# Altium schematic sheet 原理图.SchDoc
size A4
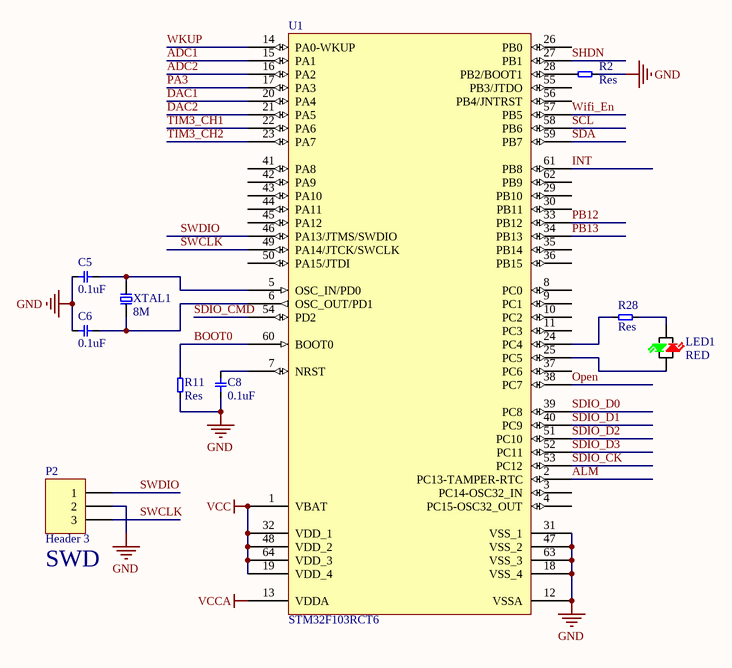
[diagram p0: 原理图.SchDoc]

## Parts
C5  0.1uF  [0603]
C6  0.1uF  [0603]
C8  0.1uF  [0603]
LED1  RED  [LED2]
P2  Header 3  [HDR1X3-150]
R2  Res  [0603]
R11  Res  [0603]
R28  Res  [0603]
U1  STM32F103RCT6  [LQFP64_N]
XTAL1  8M  [XTAL]

## Nets
GND: C5.1 C6.1 C8.1 P2.2 R2.2 R11.1 U1.12(VSSA) U1.18(VSS_4) U1.31(VSS_1) U1.47(VSS_2) U1.63(VSS_3)
VCC: U1.1(VBAT) U1.19(VDD_4) U1.32(VDD_1) U1.48(VDD_2) U1.64(VDD_3)
VCCA: U1.13(VDDA)
ADC1: U1.15(PA1)
ADC2: U1.16(PA2)
ALM: U1.2(PC13-TAMPER-RTC)
BOOT0: R11.2 U1.60(BOOT0)
DAC1: U1.20(PA4)
DAC2: U1.21(PA5)
INT: U1.61(PB8)
Open: U1.38(PC7)
PA3: U1.17(PA3)
PB12: U1.33(PB12)
PB13: U1.34(PB13)
SCL: U1.58(PB6)
SDA: U1.59(PB7)
SDIO_CK: U1.53(PC12)
SDIO_CMD: U1.54(PD2)
SDIO_D0: U1.39(PC8)
SDIO_D1: U1.40(PC9)
SDIO_D2: U1.51(PC10)
SDIO_D3: U1.52(PC11)
SHDN: U1.27(PB1)
SWCLK: P2.3 U1.49(PA14/JTCK/SWCLK)
SWDIO: P2.1 U1.46(PA13/JTMS/SWDIO)
TIM3_CH1: U1.22(PA6)
TIM3_CH2: U1.23(PA7)
Wifi_En: U1.57(PB5)
WKUP: U1.14(PA0-WKUP)
NetC5_2: C5.2 U1.5(OSC_IN/PD0) XTAL1.2
NetC6_2: C6.2 U1.6(OSC_OUT/PD1) XTAL1.1
NetC8_2: C8.2 U1.7(NRST)
NetLED1_1: LED1.1 R28.2
NetLED1_2: LED1.2 U1.25(PC5)
NetR2_1: R2.1 U1.28(PB2/BOOT1)
NetR28_1: R28.1 U1.24(PC4)

Not connected (* = marked no-connect by the designer): U1 3(PC14-OSC32_IN) 4(PC15-OSC32_OUT) 8(PC0) 9(PC1) 10(PC2) 11(PC3) 26(PB0) 29(PB10) 30(PB11) 35(PB14) 36(PB15) 37(PC6) 41(PA8) 42(PA9) 43(PA10) 44(PA11) 45(PA12) 50(PA15/JTDI) 55(PB3/JTDO) 56(PB4/JNTRST) 62(PB9)

## Notes on the sheet
- (near P2) SWD

## Library data of the parts
C5 C6 C8 = C0.1uF
LED1 = LED_2
P2 = Header 3: Header, 3-Pin; LatestRevisionDate: 17-Jul-2002; LatestRevisionNote: Re-released for DXP Platform.; Publisher: Altium Limited
U1 = STM32F103RBT6: STM32 ARM-based 32-bit MCU with 128 Kbytes Flash, 64-pin LQFP, Industrial Temperature; Published: 30-May-2008; DatasheetVersion: rev6, Mar-2008; PackageVersion: Mar-2008; PackageReference: LQFP64; Publisher: Altium Limited; PackageDescription: 64-Pin Low-Profile Quad Flat Pack, 10 x 10 mm Body, 0.5 mm Pitch (LQFP64); ComponentLink1Description: Manufacturer Link; ComponentLink1URL: www.st.com/stm32; ComponentLink2Description: Datasheet; ComponentLink2URL: http://www.st.com/stonline/products/literature/ds/13587.pdf
XTAL1 = XTAL